# Altium project HAB-Balloon-Board.PrjPcb (part 1 of 3)
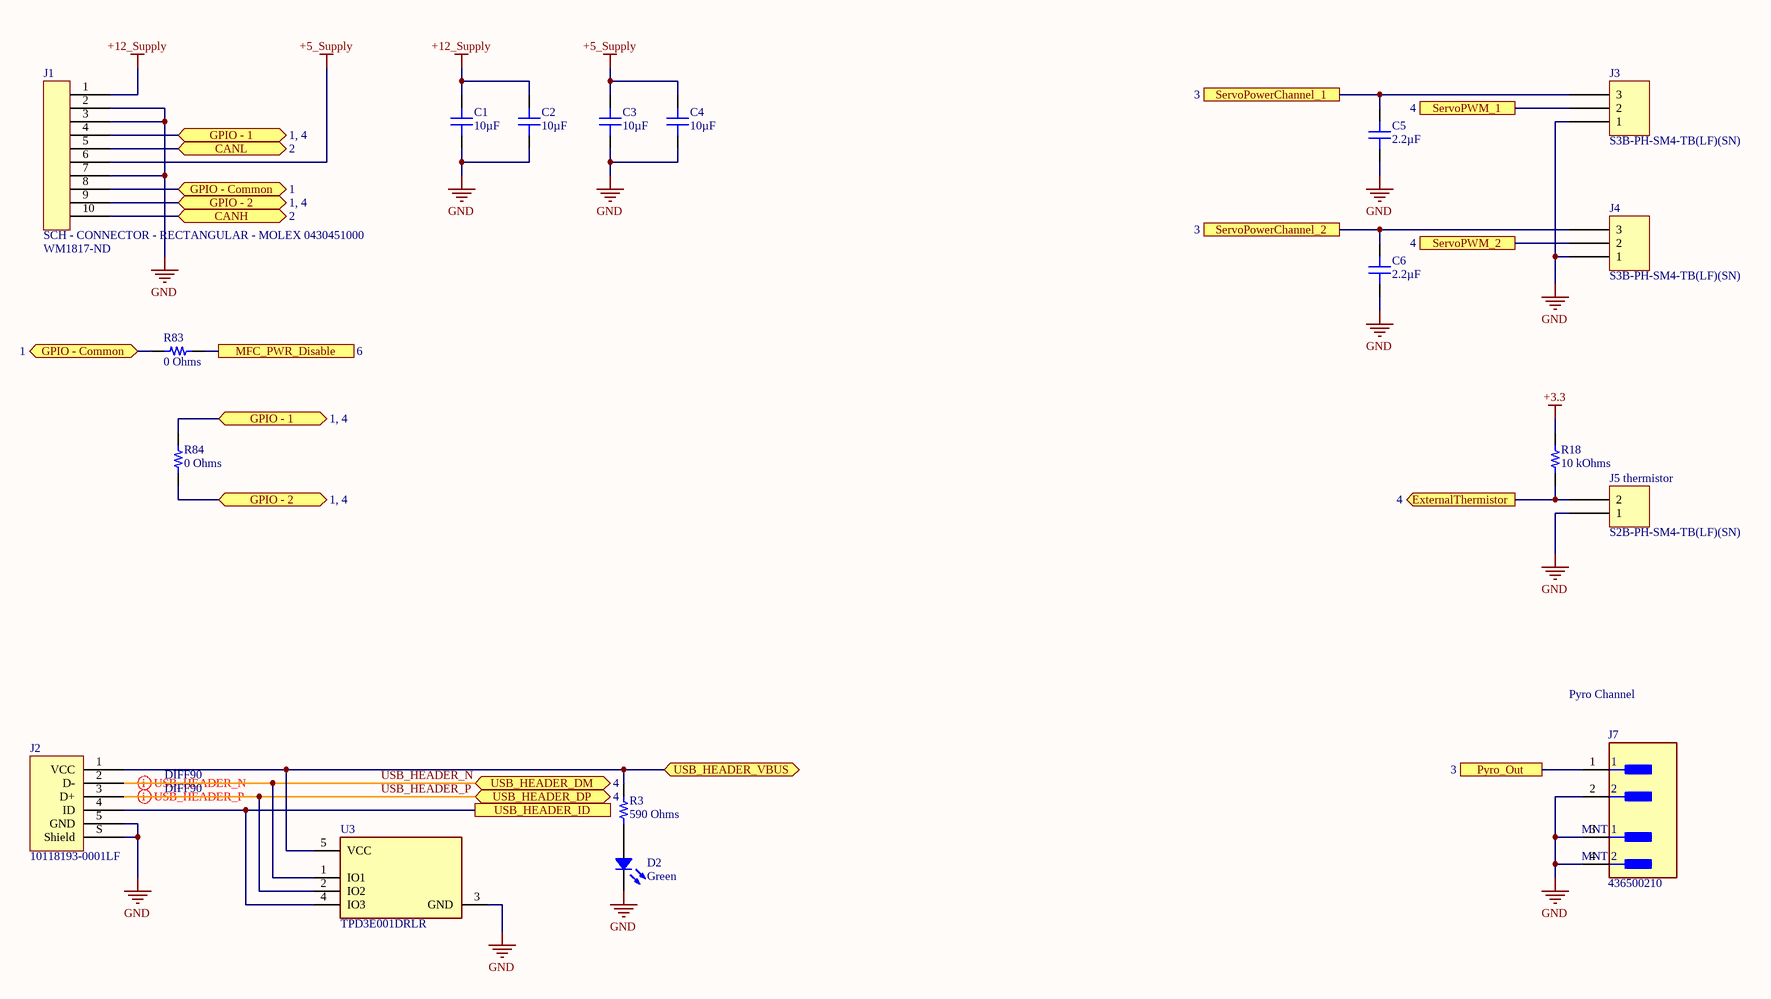
[diagram p0: Interfaces.SchDoc]
7 sheets, 210 parts. Net scope: flat (ports and power ports of the same name join across sheets).
Board file: BalloonBoard.PcbDoc
Sheets:
  Interfaces.SchDoc
  Transceivers.SchDoc
  Controllers.SchDoc
  Microcontroller.SchDoc
  Sensors.SchDoc
  Power-Supplies.SchDoc
  12V-Power-Supplies.SchDoc

## Sheet Interfaces.SchDoc: Payload Card Interfaces
size A3; Revision: 1A; SheetNumber: 1; SheetTotal: 7; Organization: Brickworks; Address1: Matthew Glazer; Address2: Design Engineer

### Parts
C1  10µF  [CAP 0805_2012]
C2  10µF  [CAP 0805_2012]
C3  10µF  [CAP 0805_2012]
C4  10µF  [CAP 0805_2012]
C5  2.2µF  [CAP 0603_1608]
C6  2.2µF  [CAP 0603_1608]
D2  Green  [LED 0603_1608 GREEN]
J1  SCH - CONNECTOR - RECTANGULAR - MOLEX 0430451000  Supplier Part Number 1: WM1817-ND  [PCB - CONNECTOR - RECTANGULAR - MOLEX 0430451000]
J2  10118193-0001LF  [FCI USB 10118193-0001LF]
J3  S3B-PH-SM4-TB(LF)(SN)  [JST S3B-PH-SM4-TB]
J4  S3B-PH-SM4-TB(LF)(SN)  [JST S3B-PH-SM4-TB]
J5  S2B-PH-SM4-TB(LF)(SN)  [JST S2B-PH-SM4-TB]
J7  436500210  [FP-436500210-MFG]
R3  590 Ohms  [RES 0603_1608]
R18  10 kOhms  [RES 0603_1608]
R83  0 Ohms  [RES 0603_1608]
R84  0 Ohms  [RES 0603_1608]
U3  TPD3E001DRLR  [FP-DRL0005A-MFG]

### Ports
CANH (bidir, see 2), CANL (bidir, see 2), ExternalThermistor (out, see 4), GPIO - 1 (bidir, see 1, 4), GPIO - 2 (bidir, see 1, 4), GPIO - Common (bidir, see 1), MFC_PWR_Disable (see 6), Pyro_Out (see 3), ServoPowerChannel_1 (see 3), ServoPowerChannel_2 (see 3), ServoPWM_1 (see 4), ServoPWM_2 (see 4), USB_HEADER_DM (bidir, see 4), USB_HEADER_DP (bidir, see 4), USB_HEADER_ID, USB_HEADER_VBUS (bidir)

### Nets
+3.3: R18.2
+5_Supply: C3.2 C4.2 J1.6
+12_Supply: C1.2 C2.2 J1.1
GND: C1.1 C2.1 C3.1 C4.1 C5.1 C6.1 D2.2 J1.2 J1.3 J1.7 J2.5(GND) J2.S(Shield) J3.1 J4.1 J5.1 J7.2 J7.3(MNT_1) J7.4(MNT_2) U3.3(GND)
USB_HEADER_N: J2.2(D-) U3.1(IO1) ; port USB_HEADER_DM
USB_HEADER_P: J2.3(D+) U3.2(IO2) ; port USB_HEADER_DP
NetC5_2: C5.2 J3.3 ; port ServoPowerChannel_1
NetC6_2: C6.2 J4.3 ; port ServoPowerChannel_2
NetD1_1: R83.2 ; port MFC_PWR_Disable
NetD2_1: D2.1 R3.1
NetD4_1: J1.5 ; port CANL
NetD4_2: J1.10 ; port CANH
NetJ1_4: J1.4 R84.2 ; port GPIO - 1
NetJ1_8: J1.8 R83.1 ; port GPIO - Common
NetJ1_9: J1.9 R84.1 ; port GPIO - 2
NetJ2_1: J2.1(VCC) R3.2 U3.5(VCC) ; port USB_HEADER_VBUS
NetJ2_4: J2.4(ID) U3.4(IO3) ; port USB_HEADER_ID
NetJ3_2: J3.2 ; port ServoPWM_1
NetJ4_2: J4.2 ; port ServoPWM_2
NetJ5_2: J5.2 R18.1 ; port ExternalThermistor
NetJ7_1: J7.1 ; port Pyro_Out

### Layout directives
differential pair; differential pair class DIFF90: USB_HEADER_N, USB_HEADER_P

### Notes on the sheet
- (near J5) thermistor
- Pyro Channel
- Title
- Size:
- Date:
- A3
- Number:
- Time:
- Revision:
- Sheet
- of
- File:

### Library data of the parts
C1-C4 = CC0805KKX5R7BB106: CAP CER 10UF 16V X5R 0805; Manufacturer: Yageo; Tolerance: ±10%; Part Number: CC0805KKX5R7BB106; Value: 10µF; Applications: General Purpose; Capacitance: 10µF; ComponentLink1Description: Datasheet; ComponentLink1URL: https://www.yageo.com/upload/media/product/productsearch/datasheet/mlcc/UPY-GPHC_X5R_4V-to-50V_25.pdf; ComponentLink2Description: DigiKey Link; ComponentLink2URL: http://digikey.com/product-detail/en/yageo/CC0805KKX5R7BB106/311-1865-1-ND/5195767; Device Package: 0805 (2012 Metric); LastUpdated: 9/2/2020 1:04:30 AM; Lifecycle Status: Active; Minimum Order: 1; Mounting Type: Surface Mount, MLCC; Operating Temperature: -55°C ~ 85°C; Package / Case: 0805 (2012 Metric); Packaging: TapeAndReel; PartId: 8867; Part Status: Active; Price: 0.09; Series: CC; Size / Dimension: 0.079" L x 0.049" W (2.00mm x 1.25mm); Supplier 1: DigiKey; Supplier Part Number 1: 311-1865-1-ND; Temperature Coefficient: X5R; Thickness (Max): 0.057" (1.45mm); Voltage - Rated: 16V
C5 C6 = EMK107BJ225KA-T: CAP CER 2.2UF 16V X5R 0603; Manufacturer: Taiyo Yuden; Tolerance: ±10%; Part Number: EMK107BJ225KA-T; Value: 2.2µF; Applications: General Purpose; Capacitance: 2.2µF; ComponentLink1Description: Datasheet; ComponentLink1URL: https://ds.yuden.co.jp/TYCOMPAS/ut/detail?pn=EMK107BJ225KA-T  &u=M; ComponentLink2Description: DigiKey Link; ComponentLink2URL: http://digikey.com/product-detail/en/taiyo-yuden/EMK107BJ225KA-T/587-1430-1-ND/1004061; Device Package: 0603 (1608 Metric); LastUpdated: 9/2/2020 1:03:30 AM; Lifecycle Status: Active; Minimum Order: 1; Mounting Type: Surface Mount, MLCC; Operating Temperature: -55°C ~ 85°C; Package / Case: 0603 (1608 Metric); Packaging: TapeAndReel; PartId: 5619; Part Status: Active; Price: 0.02; Series: M; Size / Dimension: 0.063" L x 0.031" W (1.60mm x 0.80mm); Supplier 1: DigiKey; Supplier Part Number 1: 587-1430-1-ND; Temperature Coefficient: X5R; Thickness (Max): 0.035" (0.90mm); Voltage - Rated: 16V
D2 = LTST-C193KGKT-5A: LED GREEN CLEAR CHIP SMD; Manufacturer: Lite-On Inc.; Configuration: Standard; Current - Test: 5mA; Lens Color: Colorless; Lens Size: 1.15mm x 0.80mm; Lens Style: Rectangle with Flat Top; Millicandela Rating: 16.25mcd; Viewing Angle: 130°; Voltage - Forward (Vf) (Typ): 2V; Wavelength - Dominant: 572nm; Wavelength - Peak: 574nm; Part Number: LTST-C193KGKT-5A; Color: Green; ComponentLink1Description: Datasheet; ComponentLink1URL: http://optoelectronics.liteon.com/upload/download/DS22-2007-0094/LTST-C193KGKT-5A.PDF; ComponentLink2Description: DigiKey Link; ComponentLink2URL: http://digikey.com/product-detail/en/lite-on-inc/LTST-C193KGKT-5A/160-1828-1-ND/2356247; Device Package: 0603 (1608 Metric); Height (Max): 0.45mm; LastUpdated: 9/2/2020 1:20:41 AM; Lens Transparency: Clear; Lifecycle Status: Active; Minimum Order: 1; Mounting Type: Surface Mount; Package / Case: 0603 (1608 Metric); Packaging: TapeAndReel; PartId: 694; Part Status: Active; Price: 0.06; Series: -; Size / Dimension: 1.60mm L x 0.80mm W; Supplier 1: DigiKey; Supplier Part Number 1: 160-1828-1-ND; Supplier Device Package: Chip LED; Value: Green
J2 = 10118193-0001LF: CONN RCPT USB2.0 MICRO B SMD R/A; Manufacturer: Amphenol ICC (FCI); Connector Type: USB - micro B; Current Rating (Amps): 1.8A per Contact; Gender: Receptacle; Mating Cycles: 10000; Number of Contacts: 5; Number of Ports: 1; Shielding: Shielded; Voltage - Rated: 100VAC; Part Number: 10118193-0001LF; ComponentLink1Description: Datasheet; ComponentLink1URL: https://cdn.amphenol-icc.com/media/wysiwyg/files/documentation/datasheet/inputoutput/io_usb_micro.pdf; ComponentLink2Description: DigiKey Link; ComponentLink2URL: //digikey.com/product-detail/en/amphenol-icc-fci/10118193-0001LF/609-4616-2-ND/2785388; Features: Solder Retention; LastUpdated: 12/9/2019 8:51:28 PM; Lifecycle Status: 0; Minimum Order: 1; Mounting Feature: Horizontal; Mounting Type: Surface Mount, Right Angle; Through Hole; Operating Temperature: -30°C ~ 80°C; Packaging: TapeAndReel; Part Status: Active; Price: 0.21; Series: -; Specifications: USB 2.0; Supplier 1: DigiKey; Supplier Part Number 1: 609-4616-2-ND; Termination: Solder
J3 J4 = S3B-PH-SM4-TB(LF)(SN): CONN HEADER SMD R/A 3POS 2MM; Manufacturer: JST Sales America Inc.; Contact Length - Mating: 0.130" (3.30mm); Current Rating (Amps): 2A; Material Flammability Rating: UL94 V-0; Number of Positions: 3; Number of Positions Loaded: All; Pitch - Mating: 0.079" (2.00mm); Shrouding: Shrouded - 4 Wall; Style: Board to Cable/Wire; Voltage Rating: 100V; Part Number: S3B-PH-SM4-TB(LF)(SN); ComponentLink1Description: Datasheet; ComponentLink1URL: http://www.jst-mfg.com/product/pdf/eng/ePH.pdf; ComponentLink2Description: DigiKey Link; ComponentLink2URL: http://digikey.com/product-detail/en/jst-sales-america-inc/S3B-PH-SM4-TB-LF-SN/455-1750-1-ND/926847; Connector Type: Header; Contact Finish - Mating: Tin; Contact Finish - Post: Tin; Contact Material: Copper Alloy; Contact Shape: Square; Contact Type: Male Pin; Fastening Type: Detent Lock; Features: Solder Retention; Insulation Color: Natural; Insulation Height: 0.217" (5.51mm); Insulation Material: Polyamide (PA6T), Nylon 6T; LastUpdated: 1/15/2020 3:45:23 AM; Lifecycle Status: Active; Minimum Order: 1; Mounting Type: Surface Mount, Right Angle; Number of Rows: 1; Operating Temperature: -25°C ~ 85°C; Packaging: TapeAndReel; PartId: 116; Part Status: Active; Price: 0.32; Series: PH; Supplier 1: DigiKey; Supplier Part Number 1: 455-1750-1-ND; Termination: Solder
J5 = S2B-PH-SM4-TB(LF)(SN): CONN HEADER SMD R/A 2POS 2MM; Manufacturer: JST Sales America Inc.; Contact Length - Mating: 0.130" (3.30mm); Current Rating (Amps): 2A; Material Flammability Rating: UL94 V-0; Number of Positions: 2; Number of Positions Loaded: All; Pitch - Mating: 0.079" (2.00mm); Shrouding: Shrouded - 4 Wall; Style: Board to Cable/Wire; Voltage Rating: 100V; Part Number: S2B-PH-SM4-TB(LF)(SN); ComponentLink1Description: Datasheet; ComponentLink1URL: http://www.jst-mfg.com/product/pdf/eng/ePH.pdf; ComponentLink2Description: DigiKey Link; ComponentLink2URL: http://digikey.com/product-detail/en/jst-sales-america-inc/S2B-PH-SM4-TB-LF-SN/455-1749-1-ND/926846; Connector Type: Header; Contact Finish - Mating: Tin; Contact Finish - Post: Tin; Contact Material: Copper Alloy; Contact Shape: Square; Contact Type: Male Pin; Fastening Type: Detent Lock; Features: Solder Retention; Insulation Color: Natural; Insulation Height: 0.217" (5.51mm); Insulation Material: Polyamide (PA6T), Nylon 6T; LastUpdated: 1/15/2020 3:45:11 AM; Lifecycle Status: Active; Minimum Order: 1; Mounting Type: Surface Mount, Right Angle; Number of Rows: 1; Operating Temperature: -25°C ~ 85°C; Packaging: TapeAndReel; PartId: 115; Part Status: Active; Price: 0.27; Series: PH; Supplier 1: DigiKey; Supplier Part Number 1: 455-1749-1-ND; Termination: Solder
J7 = CMP-04776-000082-1: CONN HEADER SMD R/A 2POS 3MM; Manufacturer: Molex; Voltage Rating: 600V; Current Rating: 8.5A; Conn Orientation: Right Angle; Number Of Contacts: 2; Conn Gender: Male; Device Class L3: unset; Contact Material: Gold,Nickel; RoHS: TRUE; Number Of Rows: 1; Manufacturer Part Number: 436500210; Category: Conn; Footprint Url: https://www.molex.com/pdm_docs/sd/436500210_sd.pdf; Temperature Range High: +105°C; Package: 436500210; Pitch: 3mm; Temperature: -40°C to +105°C; Height: 6.07mm; Lead Free: Yes; ComponentLink2Description: Datasheet; Temperature Range Low: -40°C; Digikey Description: CONN HEADER SMD R/A 2POS 3MM; Device Class L1: Connectors; Mouser Description: Conn Power HDR 2 POS 3mm Solder RA SMD 2 Terminal 1 Port Embossed T/R; ComponentLink2URL: https://www.molex.com/webdocs/datasheets/pdf/en-us/0436500210_PCB_HEADERS.pdf; Octopart: https://octopart.com/43650-0210-molex-298097; Automotive: No; Device Class L2: Headers and Wire Housings
R3 = RMCF0603FT590R: RES 590 OHM 1% 1/10W 0603; Manufacturer: Stackpole Electronics Inc; Power (Watts): 0.1W, 1/10W; Temperature Coefficient: ±100ppm/°C; Part Number: RMCF0603FT590R; Value: 590 Ohms; ComponentLink1Description: Datasheet; ComponentLink1URL: https://www.seielect.com/catalog/sei-rmcf_rmcp.pdf; ComponentLink2Description: DigiKey Link; ComponentLink2URL: http://digikey.com/product-detail/en/stackpole-electronics-inc/RMCF0603FT590R/RMCF0603FT590RCT-ND/2418096; Composition: Thick Film; Device Package: 0603 (1608 Metric); Features: Automotive AEC-Q200; Height - Seated (Max): 0.022" (0.55mm); LastUpdated: 9/2/2020 1:09:40 AM; Lifecycle Status: Active; Minimum Order: 1; Number of Terminations: 2; Operating Temperature: -55°C ~ 155°C; Package / Case: 0603 (1608 Metric); Packaging: CutTape; PartId: 23847; Part Status: Active; Price: 0.10; Ratings: AEC-Q200; Resistance: 590 Ohms; Series: RMCF; Size / Dimension: 0.061" L x 0.031" W (1.55mm x 0.80mm); Supplier 1: DigiKey; Supplier Part Number 1: RMCF0603FT590RCT-ND; Supplier Device Package: 0603; Tolerance: ±1%
R18 = RMCF0603FT10K0: RES 10K OHM 1% 1/10W 0603; Manufacturer: Stackpole Electronics Inc; Power (Watts): 0.1W, 1/10W; Temperature Coefficient: ±100ppm/°C; Part Number: RMCF0603FT10K0; Value: 10 kOhms; ComponentLink1Description: Datasheet; ComponentLink1URL: https://www.seielect.com/catalog/sei-rmcf_rmcp.pdf; ComponentLink2Description: DigiKey Link; ComponentLink2URL: http://digikey.com/product-detail/en/stackpole-electronics-inc/RMCF0603FT10K0/RMCF0603FT10K0CT-ND/1943057; Composition: Thick Film; Device Package: 0603 (1608 Metric); Features: Automotive AEC-Q200; Height - Seated (Max): 0.022" (0.55mm); LastUpdated: 9/2/2020 1:09:31 AM; Lifecycle Status: Active; Minimum Order: 1; Number of Terminations: 2; Operating Temperature: -55°C ~ 155°C; Package / Case: 0603 (1608 Metric); Packaging: CutTape; PartId: 25663; Part Status: Active; Price: 0.10; Ratings: AEC-Q200; Resistance: 10 kOhms; Series: RMCF; Size / Dimension: 0.061" L x 0.031" W (1.55mm x 0.80mm); Supplier 1: DigiKey; Supplier Part Number 1: RMCF0603FT10K0CT-ND; Supplier Device Package: 0603; Tolerance: ±1%
R83 R84 = RMCF0603ZT0R00: RES 0 OHM JUMPER 1/10W 0603; Manufacturer: Stackpole Electronics Inc; Power (Watts): 0.1W, 1/10W; Part Number: RMCF0603ZT0R00; Value: 0 Ohms; ComponentLink1Description: Datasheet; ComponentLink1URL: https://www.seielect.com/catalog/sei-rmcf_rmcp.pdf; ComponentLink2Description: DigiKey Link; ComponentLink2URL: http://digikey.com/product-detail/en/stackpole-electronics-inc/RMCF0603ZT0R00/RMCF0603ZT0R00CT-ND/1943218; Composition: Thick Film; Device Package: 0603 (1608 Metric); Features: Automotive AEC-Q200; Height - Seated (Max): 0.022" (0.55mm); LastUpdated: 9/2/2020 1:09:45 AM; Lifecycle Status: Active; Minimum Order: 1; Number of Terminations: 2; Operating Temperature: -55°C ~ 155°C; Package / Case: 0603 (1608 Metric); Packaging: CutTape; PartId: 22613; Part Status: Active; Price: 0.10; Ratings: AEC-Q200; Resistance: 0 Ohms; Series: RMCF; Size / Dimension: 0.061" L x 0.031" W (1.55mm x 0.80mm); Supplier 1: DigiKey; Supplier Part Number 1: RMCF0603ZT0R00CT-ND; Supplier Device Package: 0603; Tolerance: Jumper
U3 = CMP-0326-00052-4: TVS DIODE 5.5V SOT5; Min Supply Voltage: 900mV; Number of Bidirectional Channels: 3; Peak Pulse Power: 90W; Direction: Unidirectional; Leakage Current: 1nA; Interface: USB; Max Supply Current: 100nA; Capacitance: 1.5pF; Breakdown Voltage: 11V; Clamping Voltage: 105.5V; Power Line Protection: Yes; Packaging: Tape and Reel; Length: 1.6mm; REACH SVHC: No SVHC; Min Operating Temperature: -40°C; Lead Free: Lead Free; Max Supply Voltage: 5.5V; RoHS Compliant: Yes; Termination: SMD/SMT; Number of Channels: 3; Max Supply Voltage (DC): 5.5V; Weight: 9.9E-05oz; Package Quantity: 1; Reverse Standoff Voltage: 5.5V; Number of Pins: 5; Case/Package: SOT-553; Max Operating Temperature: 85°C; Nominal Supply Current: 1nA; Width: 1.2mm; Min Breakdown Voltage: 11V; Min Supply Voltage (DC): 900mV; Height: 0.55mm; Radiation Hardening: No; Depth: 1.2mm
J1 = SCH - CONNECTOR - RECTANGULAR - MOLEX 0430451000: Supplier 1: Digi-Key

## Sheet Transceivers.SchDoc: Payload Card Transceivers
size A3; Revision: 1A; SheetNumber: 2; SheetTotal: 7; Organization: Brickworks; Address1: Matthew Glazer; Address2: Design Engineer
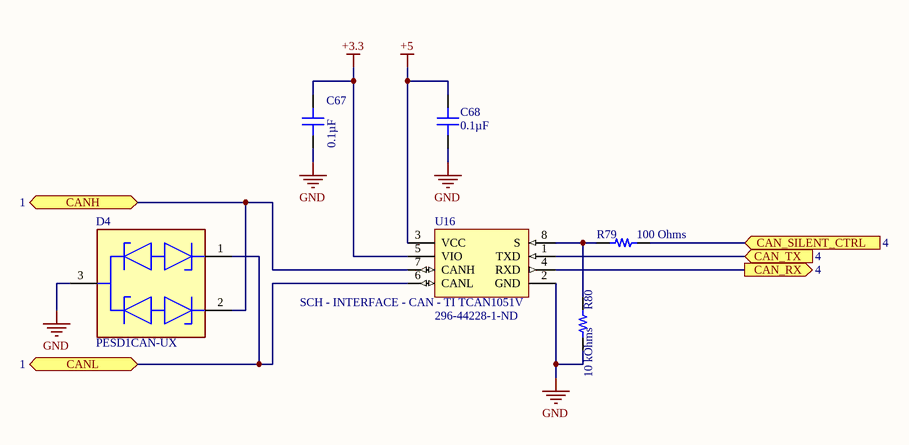
[diagram p1: Transceivers.SchDoc]

### Parts
C67  0.1µF  [CAP 0603_1608]
C68  0.1µF  [CAP 0603_1608]
D4  PESD1CAN-UX  [FP-SOT323-MFG]
R79  100 Ohms  [RES 0603_1608]
R80  10 kOhms  [RES 0603_1608]
U16  SCH - INTERFACE - CAN - TI TCAN1051V  Supplier Part Number 1: 296-44228-1-ND  [PCB - LEADS - SOIC - TI SOIC-8]

### Ports
CAN_RX (out, see 4), CAN_SILENT_CTRL (in, see 4), CAN_TX (in, see 4), CANH (bidir, see 1), CANL (bidir, see 1)

### Nets
+3.3: C67.2 U16.5(VIO)
+5: C68.2 U16.3(VCC)
GND: C67.1 C68.1 D4.3(common_cathode) R80.1 U16.2(GND)
NetD4_1: D4.1(cathode_1) U16.6(CANL) ; port CANL
NetD4_2: D4.2(cathode_2) U16.7(CANH) ; port CANH
NetR79_1: R79.1 R80.2 U16.8(S)
NetR79_2: R79.2 ; port CAN_SILENT_CTRL
NetU1_70: U16.4(RXD) ; port CAN_RX
NetU1_71: U16.1(TXD) ; port CAN_TX

### Notes on the sheet
- Title
- Size:
- Date:
- A3
- Number:
- Time:
- Revision:
- Sheet
- of
- File:

### Library data of the parts
C67 C68 = CL10B104KA8WPNC: CAP CER 0.1UF 25V X7R 0603; Manufacturer: Samsung Electro-Mechanics; Tolerance: ±10%; Part Number: CL10B104KA8WPNC; Value: 0.1µF; Applications: Automotive; Capacitance: 0.1µF; ComponentLink1Description: Datasheet; ComponentLink1URL: http://www.samsungsem.com/kr/support/product-search/mlcc/CL10B104KA8WPNC.jsp; ComponentLink2Description: DigiKey Link; ComponentLink2URL: http://digikey.com/product-detail/en/samsung-electro-mechanics/CL10B104KA8WPNC/1276-6717-1-ND/5961576; Device Package: 0603 (1608 Metric); Features: Open Mode; LastUpdated: 9/2/2020 1:03:30 AM; Lifecycle Status: Active; Minimum Order: 1; Mounting Type: Surface Mount, MLCC; Operating Temperature: -55°C ~ 125°C; Package / Case: 0603 (1608 Metric); Packaging: TapeAndReel; PartId: 5631; Part Status: Active; Price: 0.02; Ratings: AEC-Q200; Series: CL; Size / Dimension: 0.063" L x 0.031" W (1.60mm x 0.80mm); Supplier 1: DigiKey; Supplier Part Number 1: 1276-6717-1-ND; Temperature Coefficient: X7R; Thickness (Max): 0.035" (0.90mm); Voltage - Rated: 25V
D4 = CMP-14436-000006-1: TVS DIODE 24V 50V SC70-3
R79 = RMCF0603FG100R: RES 100 OHM 1% 1/10W 0603; Manufacturer: Stackpole Electronics Inc; Power (Watts): 0.1W, 1/10W; Temperature Coefficient: ±100ppm/°C; Part Number: RMCF0603FG100R; Value: 100 Ohms; ComponentLink1Description: Datasheet; ComponentLink1URL: https://www.seielect.com/catalog/sei-rmcf_rmcp.pdf; ComponentLink2Description: DigiKey Link; ComponentLink2URL: http://digikey.com/product-detail/en/stackpole-electronics-inc/RMCF0603FG100R/RMCF0603FG100RCT-ND/4425033; Composition: Thick Film; Device Package: 0603 (1608 Metric); Features: Automotive AEC-Q200; Height - Seated (Max): 0.022" (0.55mm); LastUpdated: 9/2/2020 1:09:39 AM; Lifecycle Status: Active; Minimum Order: 1; Number of Terminations: 2; Operating Temperature: -55°C ~ 155°C; Package / Case: 0603 (1608 Metric); Packaging: CutTape; PartId: 24036; Part Status: Active; Price: 0.10; Ratings: AEC-Q200; Resistance: 100 Ohms; Series: RMCF; Size / Dimension: 0.061" L x 0.031" W (1.55mm x 0.80mm); Supplier 1: DigiKey; Supplier Part Number 1: RMCF0603FG100RCT-ND; Supplier Device Package: 0603; Tolerance: ±1%
R80 = RMCF0603JT10K0: RES 10K OHM 5% 1/10W 0603; Manufacturer: Stackpole Electronics Inc; Power (Watts): 0.1W, 1/10W; Temperature Coefficient: ±200ppm/°C; Part Number: RMCF0603JT10K0; Value: 10 kOhms; ComponentLink1Description: Datasheet; ComponentLink1URL: https://www.seielect.com/catalog/sei-packaging.pdf; ComponentLink2Description: DigiKey Link; ComponentLink2URL: http://digikey.com/product-detail/en/stackpole-electronics-inc/RMCF0603JT10K0/RMCF0603JT10K0CT-ND/1943191; Composition: Thick Film; Device Package: 0603 (1608 Metric); Features: Automotive AEC-Q200; Height - Seated (Max): 0.022" (0.55mm); LastUpdated: 8/30/2020 8:48:45 PM; Lifecycle Status: Active; Minimum Order: 1; Number of Terminations: 2; Operating Temperature: -55°C ~ 155°C; Package / Case: 0603 (1608 Metric); Packaging: CutTape; PartId: 25659; Part Status: Active; Price: 0.10; Ratings: AEC-Q200; Resistance: 10 kOhms; Series: RMCF; Size / Dimension: 0.061" L x 0.031" W (1.55mm x 0.80mm); Supplier 1: DigiKey; Supplier Part Number 1: RMCF0603JT10K0CT-ND; Supplier Device Package: 0603; Tolerance: ±5%
U16 = SCH - INTERFACE - CAN - TI TCAN1051V: Supplier 1: Digi-Key

## Sheet Controllers.SchDoc: Payload Card Output Control
size A3; Revision: 1A; SheetNumber: 3; SheetTotal: 7; Organization: Brickworks; Address1: Matthew Glazer; Address2: Design Engineer
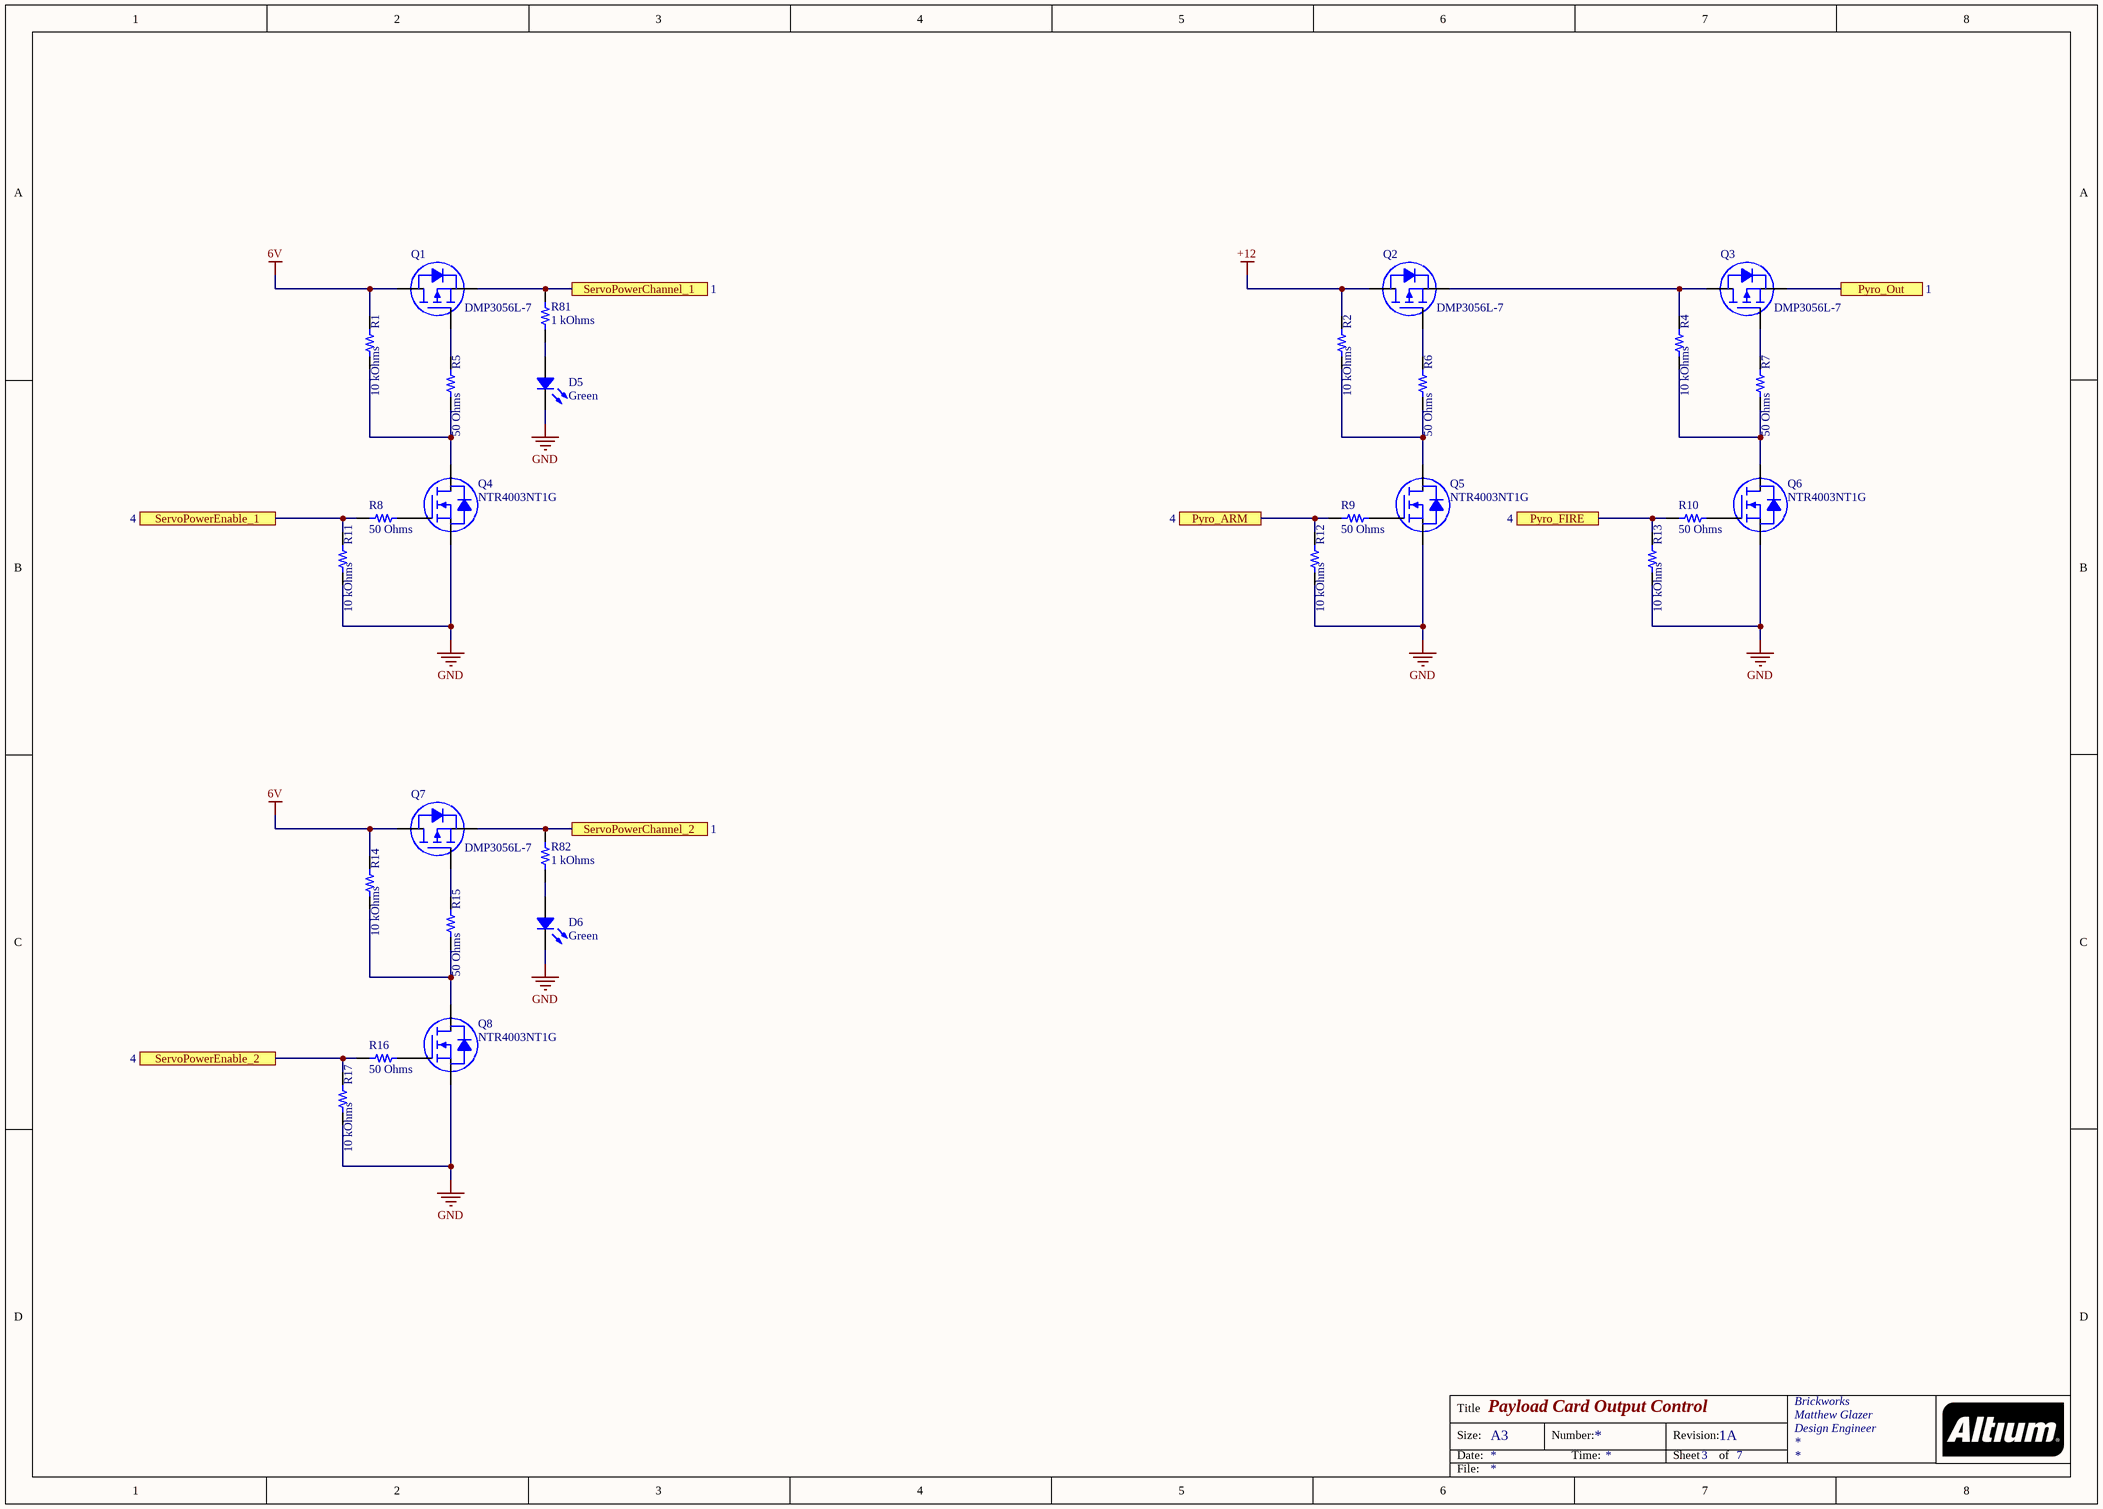
[diagram p2: Controllers.SchDoc]

### Parts
D5  Green  [LED 0603_1608 GREEN]
D6  Green  [LED 0603_1608 GREEN]
Q1  DMP3056L-7  [DIODES SOT-23-3]
Q2  DMP3056L-7  [DIODES SOT-23-3]
Q3  DMP3056L-7  [DIODES SOT-23-3]
Q4  NTR4003NT1G  [ON SEMI SOT-23-3]
Q5  NTR4003NT1G  [ON SEMI SOT-23-3]
Q6  NTR4003NT1G  [ON SEMI SOT-23-3]
Q7  DMP3056L-7  [DIODES SOT-23-3]
Q8  NTR4003NT1G  [ON SEMI SOT-23-3]
R1  10 kOhms  [RES 0603_1608]
R2  10 kOhms  [RES 0603_1608]
R4  10 kOhms  [RES 0603_1608]
R5  50 Ohms  [RES 0603_1608]
R6  50 Ohms  [RES 0603_1608]
R7  50 Ohms  [RES 0603_1608]
R8  50 Ohms  [RES 0603_1608]
R9  50 Ohms  [RES 0603_1608]
R10  50 Ohms  [RES 0603_1608]
R11  10 kOhms  [RES 0603_1608]
R12  10 kOhms  [RES 0603_1608]
R13  10 kOhms  [RES 0603_1608]
R14  10 kOhms  [RES 0603_1608]
R15  50 Ohms  [RES 0603_1608]
R16  50 Ohms  [RES 0603_1608]
R17  10 kOhms  [RES 0603_1608]
R81  1 kOhms  [RES 0603_1608]
R82  1 kOhms  [RES 0603_1608]

### Ports
Pyro_ARM (see 4), Pyro_FIRE (see 4), Pyro_Out (see 1), ServoPowerChannel_1 (see 1), ServoPowerChannel_2 (see 1), ServoPowerEnable_1 (see 4), ServoPowerEnable_2 (see 4)

### Nets
6V: Q1.3(D) Q7.3(D) R1.2 R14.2
+12: Q2.3(D) R2.2
GND: D5.2 D6.2 Q4.2(S) Q5.2(S) Q6.2(S) Q8.2(S) R11.1 R12.1 R13.1 R17.1
NetC5_2: Q1.2(S) R81.2 ; port ServoPowerChannel_1
NetC6_2: Q7.2(S) R82.2 ; port ServoPowerChannel_2
NetD5_1: D5.1 R81.1
NetD6_1: D6.1 R82.1
NetJ7_1: Q3.2(S) ; port Pyro_Out
NetQ1_1: Q1.1(G) R5.2
NetQ2_1: Q2.1(G) R6.2
NetQ2_2: Q2.2(S) Q3.3(D) R4.2
NetQ3_1: Q3.1(G) R7.2
NetQ4_1: Q4.1(G) R8.1
NetQ4_3: Q4.3(D) R1.1 R5.1
NetQ5_1: Q5.1(G) R9.1
NetQ5_3: Q5.3(D) R2.1 R6.1
NetQ6_1: Q6.1(G) R10.1
NetQ6_3: Q6.3(D) R4.1 R7.1
NetQ7_1: Q7.1(G) R15.2
NetQ8_1: Q8.1(G) R16.1
NetQ8_3: Q8.3(D) R14.1 R15.1
NetR8_2: R8.2 R11.2 ; port ServoPowerEnable_1
NetR9_2: R9.2 R12.2 ; port Pyro_ARM
NetR10_2: R10.2 R13.2 ; port Pyro_FIRE
NetR16_2: R16.2 R17.2 ; port ServoPowerEnable_2

### Notes on the sheet
- Title
- Size:
- Date:
- A3
- Number:
- Time:
- Revision:
- Sheet
- of
- File:

### Library data of the parts
D5 D6 = LTST-C193KGKT-5A: as D2 on sheet Interfaces; Part Number: LTST-C193KGKT-5A; Color: Green; ComponentLink1Description: Datasheet; ComponentLink1URL: http://optoelectronics.liteon.com/upload/download/DS22-2007-0094/LTST-C193KGKT-5A.PDF; ComponentLink2Description: DigiKey Link; ComponentLink2URL: http://digikey.com/product-detail/en/lite-on-inc/LTST-C193KGKT-5A/160-1828-1-ND/2356247; Device Package: 0603 (1608 Metric); Height (Max): 0.45mm; LastUpdated: 9/2/2020 1:20:41 AM; Lens Transparency: Clear; Lifecycle Status: Active; Minimum Order: 1; Mounting Type: Surface Mount; Package / Case: 0603 (1608 Metric); Packaging: TapeAndReel; PartId: 694; Part Status: Active; Price: 0.06; Series: -; Size / Dimension: 1.60mm L x 0.80mm W; Supplier 1: DigiKey; Supplier Part Number 1: 160-1828-1-ND; Supplier Device Package: Chip LED; Value: Green
Q1-Q3 Q7 = DMP3056L-7: MOSFET P-CH 30V 4.3A SOT23; Manufacturer: Diodes Incorporated; Current - Continuous Drain (Id) @ 25°C: 4.3A (Ta); Drive Voltage (Max Rds On,  Min Rds On): 4.5V, 10V; FET Type: P-Channel; Gate Charge (Qg) (Max) @ Vgs: 11.8nC @ 10V; Input Capacitance (Ciss) (Max) @ Vds: 642pF @ 25V; Power Dissipation (Max): 1.38W (Ta); Rds On (Max) @ Id, Vgs: 50mOhm @ 6A, 10V; Vgs (Max): ±25V; Vgs(th) (Max) @ Id: 2.1V @ 250µA; Part Number: DMP3056L-7; ComponentLink1Description: Datasheet; ComponentLink1URL: https://www.diodes.com/assets/Datasheets/DMP3056L.pdf; ComponentLink2Description: DigiKey Link; ComponentLink2URL: http://digikey.com/product-detail/en/diodes-incorporated/DMP3056L-7/DMP3056L-7DICT-ND/5126873; Drain to Source Voltage (Vdss): 30V; LastUpdated: 9/2/2020 1:25:04 AM; Lifecycle Status: Active; Minimum Order: 1; Mounting Type: Surface Mount; Operating Temperature: -55°C ~ 150°C (TJ); Package / Case: TO-236-3, SC-59, SOT-23-3; Packaging: TapeAndReel; Part Status: Active; Price: 0.11; Series: -; Supplier 1: DigiKey; Supplier Part Number 1: DMP3056L-7DICT-ND; Supplier Device Package: SOT-23; Technology: MOSFET (Metal Oxide)
Q4-Q6 Q8 = NTR4003NT1G: MOSFET N-CH 30V 500MA SOT-23; Manufacturer: ON Semiconductor; Current - Continuous Drain (Id) @ 25°C: 500mA (Ta); Drive Voltage (Max Rds On,  Min Rds On): 2.5V, 4V; FET Type: N-Channel; Gate Charge (Qg) (Max) @ Vgs: 1.15nC @ 5V; Input Capacitance (Ciss) (Max) @ Vds: 21pF @ 5V; Power Dissipation (Max): 690mW (Ta); Rds On (Max) @ Id, Vgs: 1.5Ohm @ 10mA, 4V; Vgs (Max): ±20V; Vgs(th) (Max) @ Id: 1.4V @ 250µA; Part Number: NTR4003NT1G; ComponentLink1Description: Datasheet; ComponentLink1URL: http://www.onsemi.com/pub/Collateral/NTR4003N-D.PDF; ComponentLink2Description: DigiKey Link; ComponentLink2URL: http://digikey.com/product-detail/en/on-semiconductor/NTR4003NT1G/NTR4003NT1GOSCT-ND/1967270; Drain to Source Voltage (Vdss): 30V; LastUpdated: 9/2/2020 1:25:08 AM; Lifecycle Status: Active; Minimum Order: 1; Mounting Type: Surface Mount; Operating Temperature: -55°C ~ 150°C (TJ); Package / Case: TO-236-3, SC-59, SOT-23-3; Packaging: TapeAndReel; Part Status: Active; Price: 0.05; Series: -; Supplier 1: DigiKey; Supplier Part Number 1: NTR4003NT1GOSCT-ND; Supplier Device Package: SOT-23-3 (TO-236); Technology: MOSFET (Metal Oxide)
R1 R2 R4 R11-R14 R17 = RMCF0603JT10K0: as R80 on sheet Transceivers; Part Number: RMCF0603JT10K0; Value: 10 kOhms; ComponentLink1Description: Datasheet; ComponentLink1URL: https://www.seielect.com/catalog/sei-packaging.pdf; ComponentLink2Description: DigiKey Link; ComponentLink2URL: http://digikey.com/product-detail/en/stackpole-electronics-inc/RMCF0603JT10K0/RMCF0603JT10K0CT-ND/1943191; Composition: Thick Film; Device Package: 0603 (1608 Metric); Features: Automotive AEC-Q200; Height - Seated (Max): 0.022" (0.55mm); LastUpdated: 8/30/2020 8:48:45 PM; Lifecycle Status: Active; Minimum Order: 1; Number of Terminations: 2; Operating Temperature: -55°C ~ 155°C; Package / Case: 0603 (1608 Metric); Packaging: CutTape; PartId: 25659; Part Status: Active; Price: 0.10; Ratings: AEC-Q200; Resistance: 10 kOhms; Series: RMCF; Size / Dimension: 0.061" L x 0.031" W (1.55mm x 0.80mm); Supplier 1: DigiKey; Supplier Part Number 1: RMCF0603JT10K0CT-ND; Supplier Device Package: 0603; Tolerance: ±5%
R5-R10 R15 R16 = CRCW060350R0FKEA: RES SMD 50 OHM 1% 1/10W 0603; Manufacturer: Vishay Dale; Power (Watts): 0.1W, 1/10W; Temperature Coefficient: ±100ppm/°C; Part Number: CRCW060350R0FKEA; Value: 50 Ohms; ComponentLink1Description: Datasheet; ComponentLink1URL: http://www.vishay.com/docs/20035/dcrcwe3.pdf; ComponentLink2Description: DigiKey Link; ComponentLink2URL: http://digikey.com/product-detail/en/vishay-dale/CRCW060350R0FKEA/541-3318-1-ND/6684924; Composition: Thick Film; Device Package: 0603 (1608 Metric); Features: Automotive AEC-Q200; Height - Seated (Max): 0.020" (0.50mm); LastUpdated: 9/2/2020 1:09:40 AM; Lifecycle Status: Active; Minimum Order: 1; Number of Terminations: 2; Operating Temperature: -55°C ~ 155°C; Package / Case: 0603 (1608 Metric); Packaging: CutTape; PartId: 23780; Part Status: Active; Price: 0.10; Ratings: AEC-Q200; Resistance: 50 Ohms; Series: CRCW; Size / Dimension: 0.061" L x 0.033" W (1.55mm x 0.85mm); Supplier 1: DigiKey; Supplier Part Number 1: 541-3318-1-ND; Supplier Device Package: 0603; Tolerance: ±1%
R81 R82 = RNCP0603FTD1K00: RES 1K OHM 1% 1/8W 0603; Manufacturer: Stackpole Electronics Inc; Power (Watts): 0.125W, 1/8W; Temperature Coefficient: ±100ppm/°C; Part Number: RNCP0603FTD1K00; Value: 1 kOhms; ComponentLink1Description: Datasheet; ComponentLink1URL: https://www.seielect.com/catalog/sei-rncp.pdf; ComponentLink2Description: DigiKey Link; ComponentLink2URL: http://digikey.com/product-detail/en/stackpole-electronics-inc/RNCP0603FTD1K00/RNCP0603FTD1K00CT-ND/2240445; Composition: Thin Film; Device Package: 0603 (1608 Metric); Features: Anti-Sulfur, Moisture Resistant; Height - Seated (Max): 0.020" (0.50mm); LastUpdated: 9/2/2020 1:10:23 AM; Lifecycle Status: Active; Minimum Order: 1; Number of Terminations: 2; Operating Temperature: -55°C ~ 155°C; Package / Case: 0603 (1608 Metric); Packaging: TapeAndReel; PartId: 5694; Part Status: Active; Price: 0.01; Resistance: 1 kOhms; Series: RNCP; Size / Dimension: 0.059" L x 0.031" W (1.50mm x 0.80mm); Supplier 1: DigiKey; Supplier Part Number 1: RNCP0603FTD1K00CT-ND; Supplier Device Package: 0603; Tolerance: ±1%

## Sheet Microcontroller.SchDoc: Payload Card Microcontroller
size A2; Revision: 1A; SheetNumber: 4; SheetTotal: 7; Organization: Brickworks; Address1: Matthew Glazer; Address2: Design Engineer
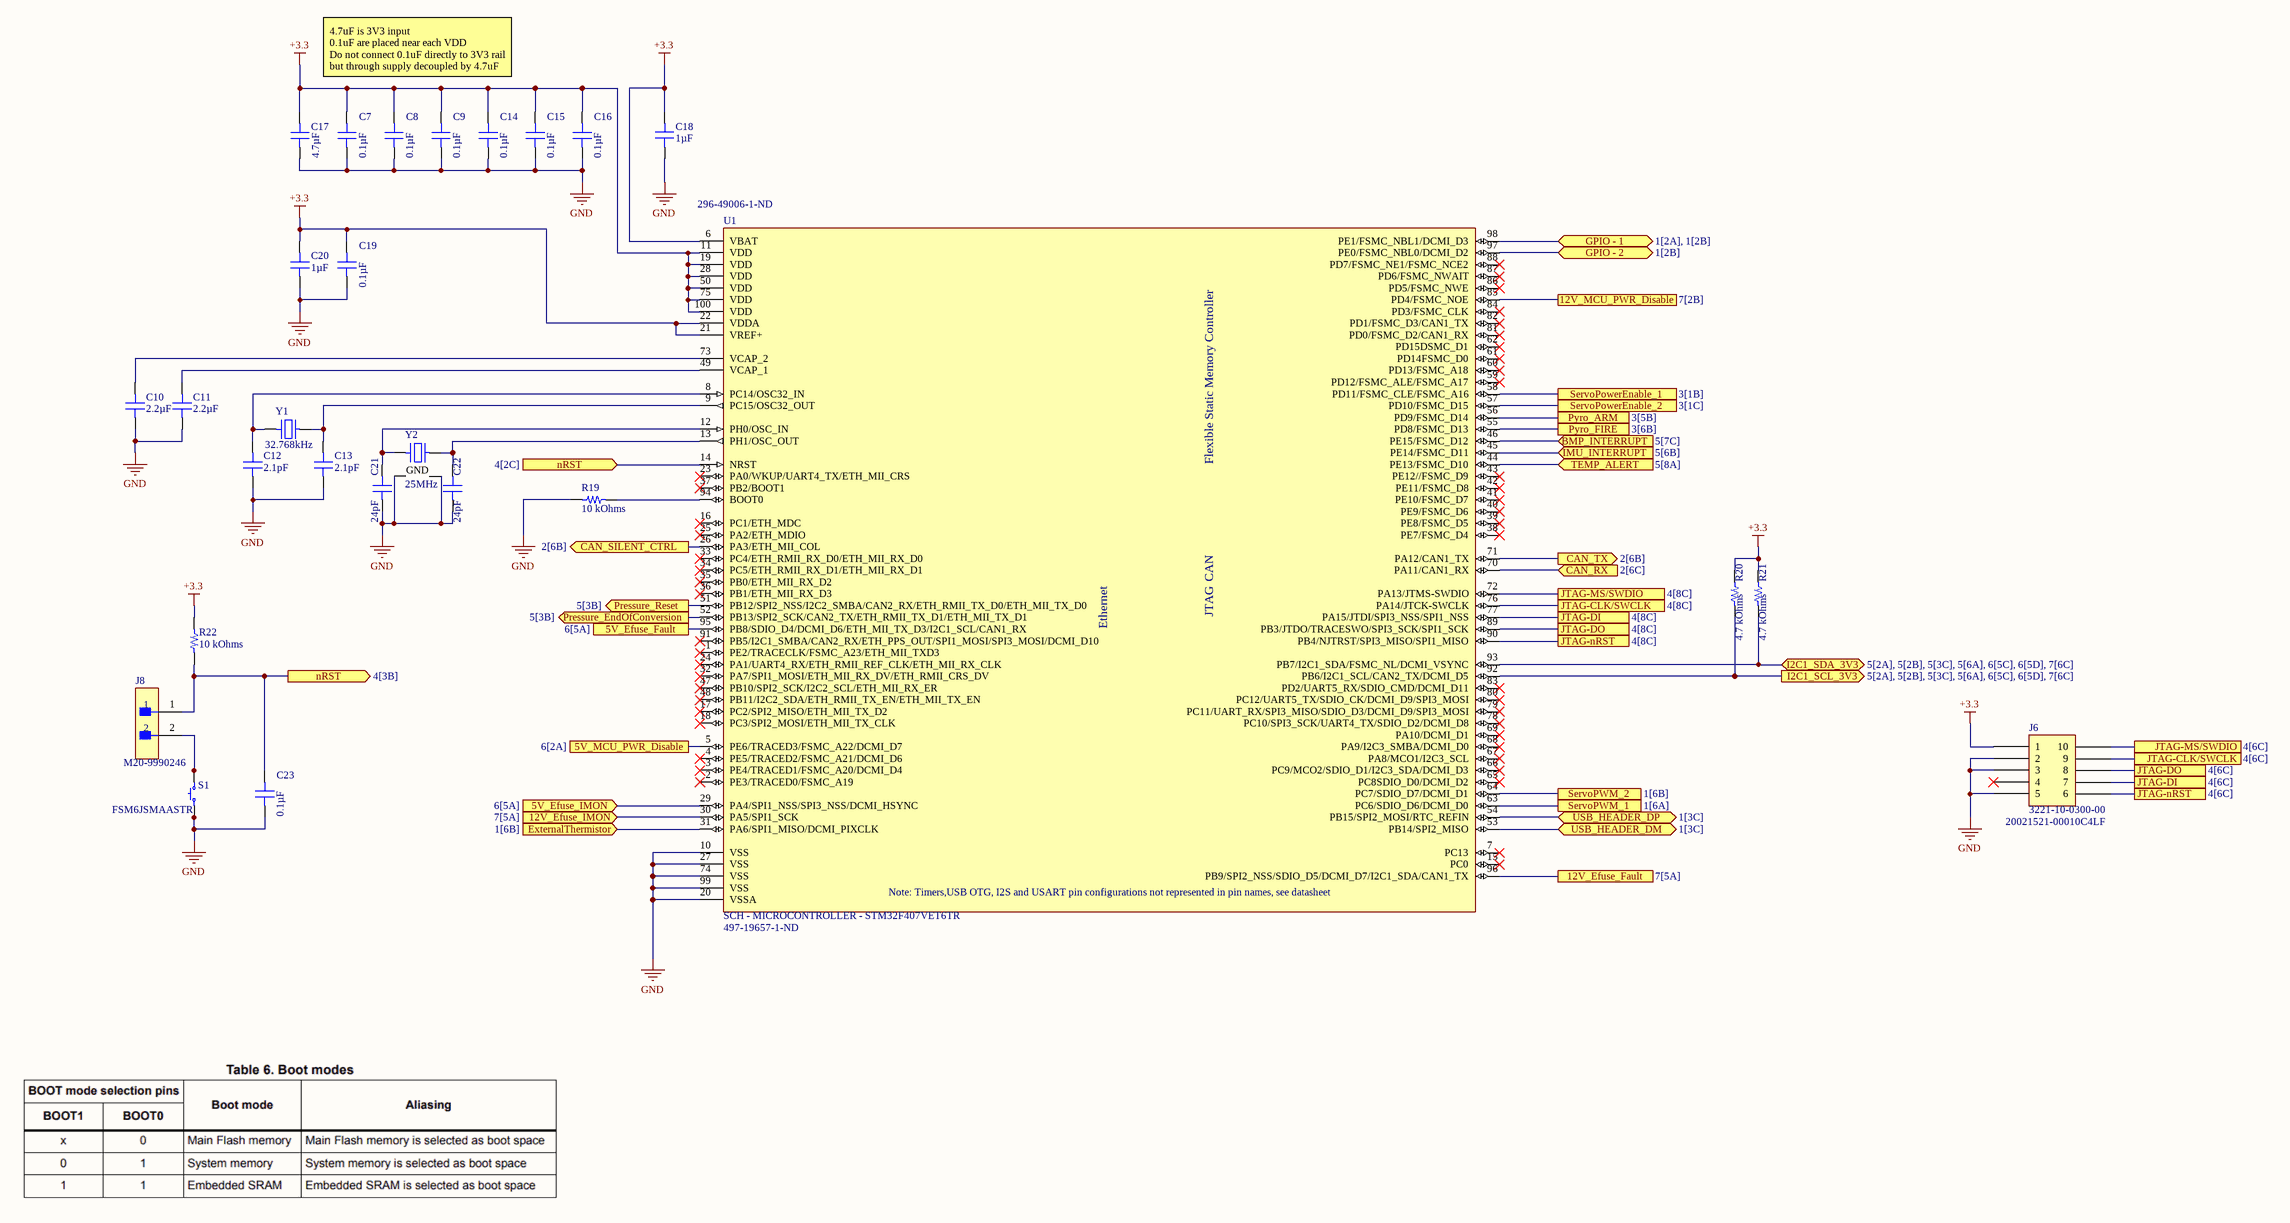
[diagram p3: Microcontroller.SchDoc]

### Parts
C7  0.1µF  [CAP 0603_1608]
C8  0.1µF  [CAP 0603_1608]
C9  0.1µF  [CAP 0603_1608]
C10  2.2µF  [CAP 0603_1608]
C11  2.2µF  [CAP 0603_1608]
C12  2.1pF  [CAP 0603_1608]
C13  2.1pF  [CAP 0603_1608]
C14  0.1µF  [CAP 0603_1608]
C15  0.1µF  [CAP 0603_1608]
C16  0.1µF  [CAP 0603_1608]
C17  4.7µF  [CAP 0603_1608]
C18  1µF  [CAP 0603_1608]
C19  0.1µF  [CAP 0603_1608]
C20  1µF  [CAP 0603_1608]
C21  24pF  [CAP 0603_1608]
C22  24pF  [CAP 0603_1608]
C23  0.1µF  [CAP 0603_1608]
J6  3221-10-0300-00  [CNC TECH 3221-10-0300-00]
J8  M20-9990246  [FP-M20-9990246-MFG]
R19  10 kOhms  [RES 0603_1608]
R20  4.7 kOhms  [RES 0603_1608]
R21  4.7 kOhms  [RES 0603_1608]
R22  10 kOhms  [RES 0603_1608]
S1  FSM6JSMAASTR  [TE FSM6JSMA]
U1  SCH - MICROCONTROLLER - STM32F407VET6TR  Supplier Part Number 1: 497-19657-1-ND  [PCB - LEADLESS - QFP - ST LQFP-100 14X14MM]
Y1  32.768kHz  [ABRACON ABS07]
Y2  25MHz  [EPSON TSX-3225]

### Ports
5V_Efuse_Fault (see 6[5A]), 5V_Efuse_IMON (in, see 6[5A]), 5V_MCU_PWR_Disable (see 6[2A]), 12V_Efuse_Fault (see 7[5A]), 12V_Efuse_IMON (in, see 7[5A]), 12V_MCU_PWR_Disable (see 7[2B]), BMP_INTERRUPT (in, see 5[7C]), CAN_RX (in, see 2[6C]), CAN_SILENT_CTRL (out, see 2[6B]), CAN_TX (out, see 2[6B]), ExternalThermistor (in, see 1[6B]), GPIO - 1 (bidir, see 1[2A], 1[2B]), GPIO - 2 (bidir, see 1[2B]), I2C1_SCL_3V3 (out, see 5[2A], 5[2B], 5[3C], 5[6A], 6[5C], 6[5D], 7[6C]), I2C1_SDA_3V3 (bidir, see 5[2A], 5[2B], 5[3C], 5[6A], 6[5C], 6[5D], 7[6C]), IMU_INTERRUPT (in, see 5[6B]), JTAG-CLK/SWCLK (see 4[6C]), JTAG-CLK/SWCLK (see 4[8C]), JTAG-DI (see 4[6C]), JTAG-DI (see 4[8C]), JTAG-DO (see 4[6C]), JTAG-DO (see 4[8C]), JTAG-MS/SWDIO (see 4[6C]), JTAG-MS/SWDIO (see 4[8C]), JTAG-nRST (see 4[6C]), JTAG-nRST (see 4[8C]), nRST (in, see 4[2C]), nRST (out, see 4[3B]), Pressure_EndOfConversion (out, see 5[3B]), Pressure_Reset (out, see 5[3B]), Pyro_ARM (see 3[5B]), Pyro_FIRE (see 3[6B]), ServoPowerEnable_1 (see 3[1B]), ServoPowerEnable_2 (see 3[1C]), ServoPWM_1 (see 1[6A]), ServoPWM_2 (see 1[6B]), TEMP_ALERT (in, see 5[8A]), USB_HEADER_DM (bidir, see 1[3C]), USB_HEADER_DP (bidir, see 1[3C])

### Nets
+3.3: C7.2 C8.2 C9.2 C14.2 C15.2 C16.2 C17.2 C18.2 C19.2 C20.2 J6.1 R20.2 R21.2 R22.1 U1.6(VBAT) U1.11(VDD) U1.19(VDD) U1.21(VREF+) U1.22(VDDA) U1.28(VDD) U1.50(VDD) U1.75(VDD) U1.100(VDD)
GND: C7.1 C8.1 C9.1 C10.1 C11.1 C12.1 C13.1 C14.1 C15.1 C16.1 C17.1 C18.1 C19.1 C20.1 C21.1 C22.1 C23.1 J6.2 J6.3 J6.5 R19.2 S1.1 S1.2 U1.10(VSS) U1.20(VSSA) U1.27(VSS) U1.74(VSS) U1.99(VSS) Y2.2(GND) Y2.4(GND)
USB_HEADER_N: U1.53(PB14/SPI2_MISO) ; port USB_HEADER_DM
USB_HEADER_P: U1.54(PB15/SPI2_MOSI/RTC_REFIN) ; port USB_HEADER_DP
NetC10_2: C10.2 U1.73(VCAP_2)
NetC11_2: C11.2 U1.49(VCAP_1)
NetC12_2: C12.2 U1.8(PC14/OSC32_IN) Y1.1
NetC13_2: C13.2 U1.9(PC15/OSC32_OUT) Y1.2
NetC21_2: C21.2 U1.12(PH0/OSC_IN) Y2.1
NetC22_2: C22.2 U1.13(PH1/OSC_OUT) Y2.3
NetC23_2: C23.2 J8.1 R22.2 U1.14(NRST) ; port nRST
NetD3_1: U1.5(PE6/TRACED3/FSMC_A22/DCMI_D7) ; port 5V_MCU_PWR_Disable
NetJ1_4: U1.98(PE1/FSMC_NBL1/DCMI_D3) ; port GPIO - 1
NetJ1_9: U1.97(PE0/FSMC_NBL0/DCMI_D2) ; port GPIO - 2
NetJ3_2: U1.63(PC6/SDIO_D6/DCMI_D0) ; port ServoPWM_1
NetJ4_2: U1.64(PC7/SDIO_D7/DCMI_D1) ; port ServoPWM_2
NetJ5_2: U1.31(PA6/SPI1_MISO/DCMI_PIXCLK) ; port ExternalThermistor
NetJ6_6: J6.6 U1.90(PB4/NJTRST/SPI3_MISO/SPI1_MISO) ; port JTAG-nRST
NetJ6_7: J6.7 U1.77(PA15/JTDI/SPI3_NSS/SPI1_NSS) ; port JTAG-DI
NetJ6_8: J6.8 U1.89(PB3/JTDO/TRACESWO/SPI3_SCK/SPI1_SCK) ; port JTAG-DO
NetJ6_9: J6.9 U1.76(PA14/JTCK-SWCLK) ; port JTAG-CLK/SWCLK
NetJ6_10: J6.10 U1.72(PA13/JTMS-SWDIO) ; port JTAG-MS/SWDIO
NetJ8_2: J8.2 S1.3 S1.4
NetR8_2: U1.58(PD11/FSMC_CLE/FSMC_A16) ; port ServoPowerEnable_1
NetR9_2: U1.56(PD9/FSMC_D14) ; port Pyro_ARM
NetR10_2: U1.55(PD8/FSMC_D13) ; port Pyro_FIRE
NetR16_2: U1.57(PD10/FSMC_D15) ; port ServoPowerEnable_2
NetR19_1: R19.1 U1.94(BOOT0)
NetR20_1: R20.1 U1.92(PB6/I2C1_SCL/CAN2_TX/DCMI_D5) ; port I2C1_SCL_3V3
NetR21_1: R21.1 U1.93(PB7/I2C1_SDA/FSMC_NL/DCMI_VSYNC) ; port I2C1_SDA_3V3
NetR28_1: U1.95(PB8/SDIO_D4/DCMI_D6/ETH_MII_TX_D3/I2C1_SCL/CAN1_RX) ; port 5V_Efuse_Fault
NetR35_2: U1.29(PA4/SPI1_NSS/SPI3_NSS/DCMI_HSYNC) ; port 5V_Efuse_IMON
NetR47_1: U1.51(PB12/SPI2_NSS/I2C2_SMBA/CAN2_RX/ETH_RMII_TX_D0/ETH_MII_TX_D0) ; port Pressure_Reset
NetR62_1: U1.96(PB9/SPI2_NSS/SDIO_D5/DCMI_D7/I2C1_SDA/CAN1_TX) ; port 12V_Efuse_Fault
NetR68_2: U1.30(PA5/SPI1_SCK) ; port 12V_Efuse_IMON
NetR71_2: U1.85(PD4/FSMC_NOE) ; port 12V_MCU_PWR_Disable
NetR79_2: U1.26(PA3/ETH_MII_COL) ; port CAN_SILENT_CTRL
NetU1_44: U1.44(PE13/FSMC_D10) ; port TEMP_ALERT
NetU1_45: U1.45(PE14/FSMC_D11) ; port IMU_INTERRUPT
NetU1_46: U1.46(PE15/FSMC_D12) ; port BMP_INTERRUPT
NetU1_52: U1.52(PB13/SPI2_SCK/CAN2_TX/ETH_RMII_TX_D1/ETH_MII_TX_D1) ; port Pressure_EndOfConversion
NetU1_70: U1.70(PA11/CAN1_RX) ; port CAN_RX
NetU1_71: U1.71(PA12/CAN1_TX) ; port CAN_TX

Not connected (* = marked no-connect by the designer): J6 4*; U1 1(PE2/TRACECLK/FSMC_A23/ETH_MII_TXD3)* 2(PE3/TRACED0/FSMC_A19)* 3(PE4/TRACED1/FSMC_A20/DCMI_D4)* 4(PE5/TRACED2/FSMC_A21/DCMI_D6)* 7(PC13)* 15(PC0)* 16(PC1/ETH_MDC)* 17(PC2/SPI2_MISO/ETH_MII_TX_D2)* 18(PC3/SPI2_MOSI/ETH_MII_TX_CLK)* 23(PA0/WKUP/UART4_TX/ETH_MII_CRS)* 24(PA1/UART4_RX/ETH_RMII_REF_CLK/ETH_MII_RX_CLK)* 25(PA2/ETH_MDIO)* 32(PA7/SPI1_MOSI/ETH_MII_RX_DV/ETH_RMII_CRS_DV)* 33(PC4/ETH_RMII_RX_D0/ETH_MII_RX_D0)* 34(PC5/ETH_RMII_RX_D1/ETH_MII_RX_D1)* 35(PB0/ETH_MII_RX_D2)* 36(PB1/ETH_MII_RX_D3)* 37(PB2/BOOT1)* 38(PE7/FSMC_D4)* 39(PE8/FSMC_D5)* 40(PE9/FSMC_D6)* 41(PE10/FSMC_D7)* 42(PE11/FSMC_D8)* 43(PE12//FSMC_D9)* 47(PB10/SPI2_SCK/I2C2_SCL/ETH_MII_RX_ER)* 48(PB11/I2C2_SDA/ETH_RMII_TX_EN/ETH_MII_TX_EN)* 59(PD12/FSMC_ALE/FSMC_A17)* 60(PD13/FSMC_A18)* 61(PD14FSMC_D0)* 62(PD15DSMC_D1)* 65(PC8SDIO_D0/DCMI_D2)* 66(PC9/MCO2/SDIO_D1/I2C3_SDA/DCMI_D3)* 67(PA8/MCO1/I2C3_SCL)* 68(PA9/I2C3_SMBA/DCMI_D0)* 69(PA10/DCMI_D1)* 78(PC10/SPI3_SCK/UART4_TX/SDIO_D2/DCMI_D8)* 79(PC11/UART_RX/SPI3_MISO/SDIO_D3/DCMI_D9/SPI3_MOSI)* 80(PC12/UART5_TX/SDIO_CK/DCMI_D9/SPI3_MOSI)* 81(PD0/FSMC_D2/CAN1_RX)* 82(PD1/FSMC_D3/CAN1_TX)* 83(PD2/UART5_RX/SDIO_CMD/DCMI_D11)* 84(PD3/FSMC_CLK)* 86(PD5/FSMC_NWE)* 87(PD6/FSMC_NWAIT)* 88(PD7/FSMC_NE1/FSMC_NCE2)* 91(PB5/I2C1_SMBA/CAN2_RX/ETH_PPS_OUT/SPI1_MOSI/SPI3_MOSI/DCMI_D10)*

### Notes on the sheet
- 4.7uF is 3V3 input
  0.1uF are placed near each VDD
  Do not connect 0.1uF directly to 3V3 rail but through supply decoupled by 4.7uF
- (near J6) 20021521-00010C4LF
- Title
- Size:
- Date:
- File:
- A2
- Number:
- Time:
- Revision:
- Sheet
- of
- (in symbol SCH - MICROCONTROLLER - STM32F407VET6TR) Flexible Static Memory Controller; CAN; JTAG; Ethernet; Note: Timers,USB OTG, I2S and USART pin configurations not represented in pin names, see datasheet

### Library data of the parts
C7-C9 C14-C16 C19 C23 = CL10B104KA8WPNC: as C67 on sheet Transceivers; Part Number: CL10B104KA8WPNC; Value: 0.1µF; Applications: Automotive; Capacitance: 0.1µF; ComponentLink1Description: Datasheet; ComponentLink1URL: http://www.samsungsem.com/kr/support/product-search/mlcc/CL10B104KA8WPNC.jsp; ComponentLink2Description: DigiKey Link; ComponentLink2URL: http://digikey.com/product-detail/en/samsung-electro-mechanics/CL10B104KA8WPNC/1276-6717-1-ND/5961576; Device Package: 0603 (1608 Metric); Features: Open Mode; LastUpdated: 9/2/2020 1:03:30 AM; Lifecycle Status: Active; Minimum Order: 1; Mounting Type: Surface Mount, MLCC; Operating Temperature: -55°C ~ 125°C; Package / Case: 0603 (1608 Metric); Packaging: TapeAndReel; PartId: 5631; Part Status: Active; Price: 0.02; Ratings: AEC-Q200; Series: CL; Size / Dimension: 0.063" L x 0.031" W (1.60mm x 0.80mm); Supplier 1: DigiKey; Supplier Part Number 1: 1276-6717-1-ND; Temperature Coefficient: X7R; Thickness (Max): 0.035" (0.90mm); Voltage - Rated: 25V
C10 C11 = EMK107BJ225KA-T: as C5 on sheet Interfaces; Part Number: EMK107BJ225KA-T; Value: 2.2µF; Applications: General Purpose; Capacitance: 2.2µF; ComponentLink1Description: Datasheet; ComponentLink1URL: https://ds.yuden.co.jp/TYCOMPAS/ut/detail?pn=EMK107BJ225KA-T  &u=M; ComponentLink2Description: DigiKey Link; ComponentLink2URL: http://digikey.com/product-detail/en/taiyo-yuden/EMK107BJ225KA-T/587-1430-1-ND/1004061; Device Package: 0603 (1608 Metric); LastUpdated: 9/2/2020 1:03:30 AM; Lifecycle Status: Active; Minimum Order: 1; Mounting Type: Surface Mount, MLCC; Operating Temperature: -55°C ~ 85°C; Package / Case: 0603 (1608 Metric); Packaging: TapeAndReel; PartId: 5619; Part Status: Active; Price: 0.02; Series: M; Size / Dimension: 0.063" L x 0.031" W (1.60mm x 0.80mm); Supplier 1: DigiKey; Supplier Part Number 1: 587-1430-1-ND; Temperature Coefficient: X5R; Thickness (Max): 0.035" (0.90mm); Voltage - Rated: 16V
C12 C13 = CBR06C219B5GAC: CAP CER RF 2.1PF 50V +/-0.1 PF C; Manufacturer: KEMET; Temperature Coefficient: C0G, NP0; Tolerance: ±0.1pF; Part Number: CBR06C219B5GAC; Value: 2.1pF; Applications: RF, Microwave, High Frequency; Capacitance: 2.1pF; ComponentLink1Description: Datasheet; ComponentLink1URL: https://api.kemet.com/component-edge/download/datasheet/CBR06C219B5GAC.pdf; ComponentLink2Description: DigiKey Link; ComponentLink2URL: http://digikey.com/product-detail/en/kemet/CBR06C219B5GAC/399-16153-1-ND/7649738; Device Package: 0603 (1608 Metric); Features: High Q, Low Loss, Ultra Low ESR; LastUpdated: 9/2/2020 1:03:15 AM; Lifecycle Status: Active; Minimum Order: 1; Mounting Type: Surface Mount, MLCC; Operating Temperature: -55°C ~ 125°C; Package / Case: 0603 (1608 Metric); Packaging: TapeAndReel; PartId: 13663; Part Status: Active; Price: 0.05; Series: CBR-SMD RF C0G; Size / Dimension: 0.063" L x 0.031" W (1.60mm x 0.80mm); Supplier 1: DigiKey; Supplier Part Number 1: 399-16153-1-ND; Thickness (Max): 0.034" (0.87mm); Voltage - Rated: 50V
C17 = C1608X5R1C475K080AC: CAP CER 4.7UF 16V X5R 0603; Manufacturer: TDK Corporation; Tolerance: ±10%; Part Number: C1608X5R1C475K080AC; Value: 4.7µF; Applications: General Purpose; Capacitance: 4.7µF; ComponentLink1Description: Datasheet; ComponentLink1URL: https://product.tdk.com/info/en/catalog/datasheets/mlcc_commercial_general_en.pdf?ref_disty=digikey; ComponentLink2Description: DigiKey Link; ComponentLink2URL: http://digikey.com/product-detail/en/tdk-corporation/C1608X5R1C475K080AC/445-7478-1-ND/2733550; Device Package: 0603 (1608 Metric); Features: Low ESL; LastUpdated: 9/2/2020 1:03:17 AM; Lifecycle Status: Active; Minimum Order: 1; Mounting Type: Surface Mount, MLCC; Operating Temperature: -55°C ~ 85°C; Package / Case: 0603 (1608 Metric); Packaging: TapeAndReel; PartId: 12901; Part Status: Active; Price: 0.06; Series: C; Size / Dimension: 0.063" L x 0.031" W (1.60mm x 0.80mm); Supplier 1: DigiKey; Supplier Part Number 1: 445-7478-1-ND; Temperature Coefficient: X5R; Thickness (Max): 0.035" (0.90mm); Voltage - Rated: 16V
C18 C20 = GCM188R71C105KA64J: CAP CER 1UF 16V X7R 0603; Manufacturer: Murata Electronics; Tolerance: ±10%; Part Number: GCM188R71C105KA64J; Value: 1µF; Applications: Automotive; Capacitance: 1µF; ComponentLink1Description: Datasheet; ComponentLink1URL: https://www.murata.com/~/media/webrenewal/support/library/catalog/products/capacitor/mlcc/c03e.ashx?la=en-us; ComponentLink2Description: DigiKey Link; ComponentLink2URL: http://digikey.com/product-detail/en/murata-electronics/GCM188R71C105KA64J/490-12657-1-ND/5797626; Device Package: 0603 (1608 Metric); LastUpdated: 9/2/2020 1:03:14 AM; Lifecycle Status: Active; Minimum Order: 1; Mounting Type: Surface Mount, MLCC; Operating Temperature: -55°C ~ 125°C; Package / Case: 0603 (1608 Metric); Packaging: TapeAndReel; PartId: 13992; Part Status: Active; Price: 0.03; Ratings: AEC-Q200; Series: GCM; Size / Dimension: 0.063" L x 0.031" W (1.60mm x 0.80mm); Supplier 1: DigiKey; Supplier Part Number 1: 490-12657-1-ND; Temperature Coefficient: X7R; Thickness (Max): 0.035" (0.90mm); Voltage - Rated: 16V
C21 C22 = CL10C240JB8NNNC: CAP CER 24PF 50V C0G/NP0 0603; Manufacturer: Samsung Electro-Mechanics; Temperature Coefficient: C0G, NP0; Tolerance: ±5%; Part Number: CL10C240JB8NNNC; Value: 24pF; Applications: General Purpose; Capacitance: 24pF; ComponentLink1Description: Datasheet; ComponentLink1URL: http://www.samsungsem.com/kr/support/product-search/mlcc/CL10C240JB8NNNC.jsp; ComponentLink2Description: DigiKey Link; ComponentLink2URL: http://digikey.com/product-detail/en/samsung-electro-mechanics/CL10C240JB8NNNC/1276-1761-1-ND/3889847; Device Package: 0603 (1608 Metric); LastUpdated: 9/2/2020 1:03:22 AM; Lifecycle Status: Active; Minimum Order: 1; Mounting Type: Surface Mount, MLCC; Operating Temperature: -55°C ~ 125°C; Package / Case: 0603 (1608 Metric); Packaging: TapeAndReel; PartId: 10003; Part Status: Active; Price: 0.01; Series: CL; Size / Dimension: 0.063" L x 0.031" W (1.60mm x 0.80mm); Supplier 1: DigiKey; Supplier Part Number 1: 1276-1761-1-ND; Thickness (Max): 0.035" (0.90mm); Voltage - Rated: 50V
J6 = 3221-10-0300-00: CONN HEADER SMD 10POS 1.27MM; Manufacturer: CNC Tech; Current Rating (Amps): 1A; Material Flammability Rating: UL94 V-0; Number of Positions: 10; Number of Positions Loaded: All; Pitch - Mating: 0.050" (1.27mm); Shrouding: Shrouded - 4 Wall; Style: Board to Cable/Wire; Part Number: 3221-10-0300-00; ComponentLink1Description: Datasheet; ComponentLink1URL: http://cnctech.us/idcmatching2.pdf; ComponentLink2Description: DigiKey Link; ComponentLink2URL: http://digikey.com/product-detail/en/cnc-tech/3221-10-0300-00/1175-1735-ND/4878946; Connector Type: Header; Contact Finish - Mating: Gold; Contact Finish - Post: Gold; Contact Finish Thickness - Mating: Flash; Contact Material: Brass; Contact Shape: Square; Contact Type: Male Pin; Fastening Type: Push-Pull; Features: Keying Slot; Insulation Height: 0.213" (5.40mm); Insulation Material: Polyamide (PA6T), Nylon 6T; LastUpdated: 1/13/2020 12:09:21 AM; Lifecycle Status: Active; Minimum Order: 1; Mounting Type: Surface Mount; Number of Rows: 2; Operating Temperature: -40°C ~ 105°C; Packaging: Tray; PartId: 109; Part Status: Active; Price: 0.73; Row Spacing - Mating: 0.050" (1.27mm); Series: -; Supplier 1: DigiKey; Supplier Part Number 1: 1175-1735-ND; Termination: Solder
J8 = CMP-15831-000009-1: CONN HEADER VERT 2POS 2.54MM; Manufacturer: Harwin; Conn Gender: Male; Conn Orientation: Vertical; Number Of Contacts: 2; Current Rating: 3A; ComponentLink2URL: https://cdn.harwin.com/pdfs/M20-999.pdf; ComponentLink2Description: Datasheet; Package: M20-9990246; Temperature: -40°C to +105°C; Octopart: https://octopart.com/m20-9990246-harwin-2590635; Mouser Description: 2.54mm (0.1") Pitch SIL Vertical PC Tail Pin Header, 6.1mm mating pin height, tin, 2 contacts; Temperature Range High: +105°C; Device Class L1: Connectors; RoHS: TRUE; Automotive: No; Height: 8.99mm; Number Of Rows: 1; Contact Material: Tin,Nickel; Category: Conn; Pitch: 2.54mm; Lead Free: Yes; Digikey Description: CONN HEADER VERT 2POS 2.54MM; Manufacturer Part Number: M20-9990246; Temperature Range Low: -40°C; Device Class L3: unset; Device Class L2: Headers and Wire Housings
R19 R22 = RMCF0603JT10K0: as R80 on sheet Transceivers; Part Number: RMCF0603JT10K0; Value: 10 kOhms; ComponentLink1Description: Datasheet; ComponentLink1URL: https://www.seielect.com/catalog/sei-packaging.pdf; ComponentLink2Description: DigiKey Link; ComponentLink2URL: http://digikey.com/product-detail/en/stackpole-electronics-inc/RMCF0603JT10K0/RMCF0603JT10K0CT-ND/1943191; Composition: Thick Film; Device Package: 0603 (1608 Metric); Features: Automotive AEC-Q200; Height - Seated (Max): 0.022" (0.55mm); LastUpdated: 8/30/2020 8:48:45 PM; Lifecycle Status: Active; Minimum Order: 1; Number of Terminations: 2; Operating Temperature: -55°C ~ 155°C; Package / Case: 0603 (1608 Metric); Packaging: CutTape; PartId: 25659; Part Status: Active; Price: 0.10; Ratings: AEC-Q200; Resistance: 10 kOhms; Series: RMCF; Size / Dimension: 0.061" L x 0.031" W (1.55mm x 0.80mm); Supplier 1: DigiKey; Supplier Part Number 1: RMCF0603JT10K0CT-ND; Supplier Device Package: 0603; Tolerance: ±5%
R20 R21 = RMCF0603FT4K70: RES 4.7K OHM 1% 1/10W 0603; Manufacturer: Stackpole Electronics Inc; Power (Watts): 0.1W, 1/10W; Temperature Coefficient: ±100ppm/°C; Part Number: RMCF0603FT4K70; Value: 4.7 kOhms; ComponentLink1Description: Datasheet; ComponentLink1URL: https://www.seielect.com/catalog/sei-rmcf_rmcp.pdf; ComponentLink2Description: DigiKey Link; ComponentLink2URL: http://digikey.com/product-detail/en/stackpole-electronics-inc/RMCF0603FT4K70/RMCF0603FT4K70CT-ND/1943033; Composition: Thick Film; Device Package: 0603 (1608 Metric); Features: Automotive AEC-Q200; Height - Seated (Max): 0.022" (0.55mm); LastUpdated: 9/2/2020 1:10:22 AM; Lifecycle Status: Active; Minimum Order: 1; Number of Terminations: 2; Operating Temperature: -55°C ~ 155°C; Package / Case: 0603 (1608 Metric); Packaging: CutTape; PartId: 6078; Part Status: Active; Price: 0.10; Ratings: AEC-Q200; Resistance: 4.7 kOhms; Series: RMCF; Size / Dimension: 0.061" L x 0.031" W (1.55mm x 0.80mm); Supplier 1: DigiKey; Supplier Part Number 1: RMCF0603FT4K70CT-ND; Supplier Device Package: 0603; Tolerance: ±1%
S1 = FSM6JSMAASTR: SWITCH TACTILE SPST-NO 0.05A 24V; Manufacturer: TE Connectivity ALCOSWITCH Switches; Actuator Height off PCB, Vertical: 7.00mm; Actuator Orientation: Top Actuated; Actuator Type: Standard; Contact Rating @ Voltage: 0.05A @ 24VDC; Illumination: Non-Illuminated; Operating Force: 260gf; Outline: 6.00mm x 6.00mm; Switch Function: Off-Mom; Part Number: FSM6JSMAASTR; Circuit: SPST-NO; ComponentLink1Description: Datasheet; ComponentLink1URL: https://www.te.com/commerce/DocumentDelivery/DDEController?Action=srchrtrv&DocNm=1308111-1_SWITCHES_CORE_PROGRAM_CATALOG&DocType=CS&DocLang=English; ComponentLink2Description: DigiKey Link; ComponentLink2URL: http://digikey.com/product-detail/en/te-connectivity-alcoswitch-switches/FSM6JSMAASTR/450-2138-1-ND/5343818; LastUpdated: 9/2/2020 1:27:08 AM; Lifecycle Status: Active; Minimum Order: 1; Mounting Type: Surface Mount; Operating Temperature: -40°C ~ 105°C; Packaging: TapeAndReel; Part Status: Active; Price: 0.37; Series: FSMJSMA; Supplier 1: DigiKey; Supplier Part Number 1: 450-2138-1-ND; Termination Style: Gull Wing
Y1 = ABS07-166-32.768KHZ-T: IOT 32.786KHZ XTAL; Manufacturer: Abracon LLC; ESR (Equivalent Series Resistance): 70 kOhms; Frequency Tolerance: ±10ppm; Load Capacitance: 7pF; Operating Mode: Fundamental; Part Number: ABS07-166-32.768KHZ-T; ComponentLink1Description: Datasheet; ComponentLink1URL: https://abracon.com/datasheets/ABS07-166-32.768kHz-T.pdf; ComponentLink2Description: DigiKey Link; ComponentLink2URL: http://digikey.com/product-detail/en/abracon-llc/ABS07-166-32.768KHZ-T/535-14514-1-ND/8827205; Frequency: 32.768kHz; Height - Seated (Max): 0.035" (0.90mm); LastUpdated: 9/2/2020 1:21:47 AM; Lifecycle Status: Active; Minimum Order: 1; Mounting Type: Surface Mount; Operating Temperature: -40°C ~ 85°C; Package / Case: 2-SMD, No Lead; Packaging: TapeAndReel; PartId: 384; Part Status: Active; Price: 0.35; Series: ABS07; Size / Dimension: 0.126" L x 0.059" W (3.20mm x 1.50mm); Supplier 1: DigiKey; Supplier Part Number 1: 535-14514-1-ND; Type: kHz Crystal (Tuning Fork); Value: 32.768kHz
Y2 = TSX-3225 25.0000MF20P-C0: CRYSTAL 25.0000MHZ 18PF SMD; Manufacturer: EPSON; ESR (Equivalent Series Resistance): 40 Ohms; Frequency Stability: ±20ppm; Frequency Tolerance: ±10ppm; Operating Mode: Fundamental; Part Number: TSX-3225 25.0000MF20P-C0; ComponentLink1Description: Datasheet; ComponentLink1URL: https://support.epson.biz/td/api/doc_check.php?dl=brief_TSX-3225&lang=en; ComponentLink2Description: DigiKey Link; ComponentLink2URL: http://digikey.com/product-detail/en/epson/TSX-3225-25.0000MF20P-C0/SER4212CT-ND/7430967; Frequency: 25MHz; Height - Seated (Max): 0.024" (0.60mm); LastUpdated: 9/2/2020 1:21:54 AM; Lifecycle Status: Active; Load Capacitance: 18pF; Minimum Order: 1; Mounting Type: Surface Mount; Operating Temperature: -20°C ~ 85°C; Package / Case: 4-SMD, No Lead; Packaging: TapeAndReel; PartId: 447; Part Status: Active; Price: 0.18; Series: TSX-3225; Size / Dimension: 0.126" L x 0.098" W (3.20mm x 2.50mm); Supplier 1: DigiKey; Supplier Part Number 1: SER4212CT-ND; Type: MHz Crystal; Value: 25MHz
U1 = SCH - MICROCONTROLLER - STM32F407VET6TR: Supplier 1: Digi-Key